# Altium schematic sheet ETH-PHY_SGMII_TI.SchDoc
size A4; CompanyName: Technische Hochschule Nürnberg Georg Simon Ohm; Organization: UltraZohm; Address1: Kesslerplatz 12; Address2: 90489 Nürnberg; Address3: GERMANY; Website: www.ultrazohm.com
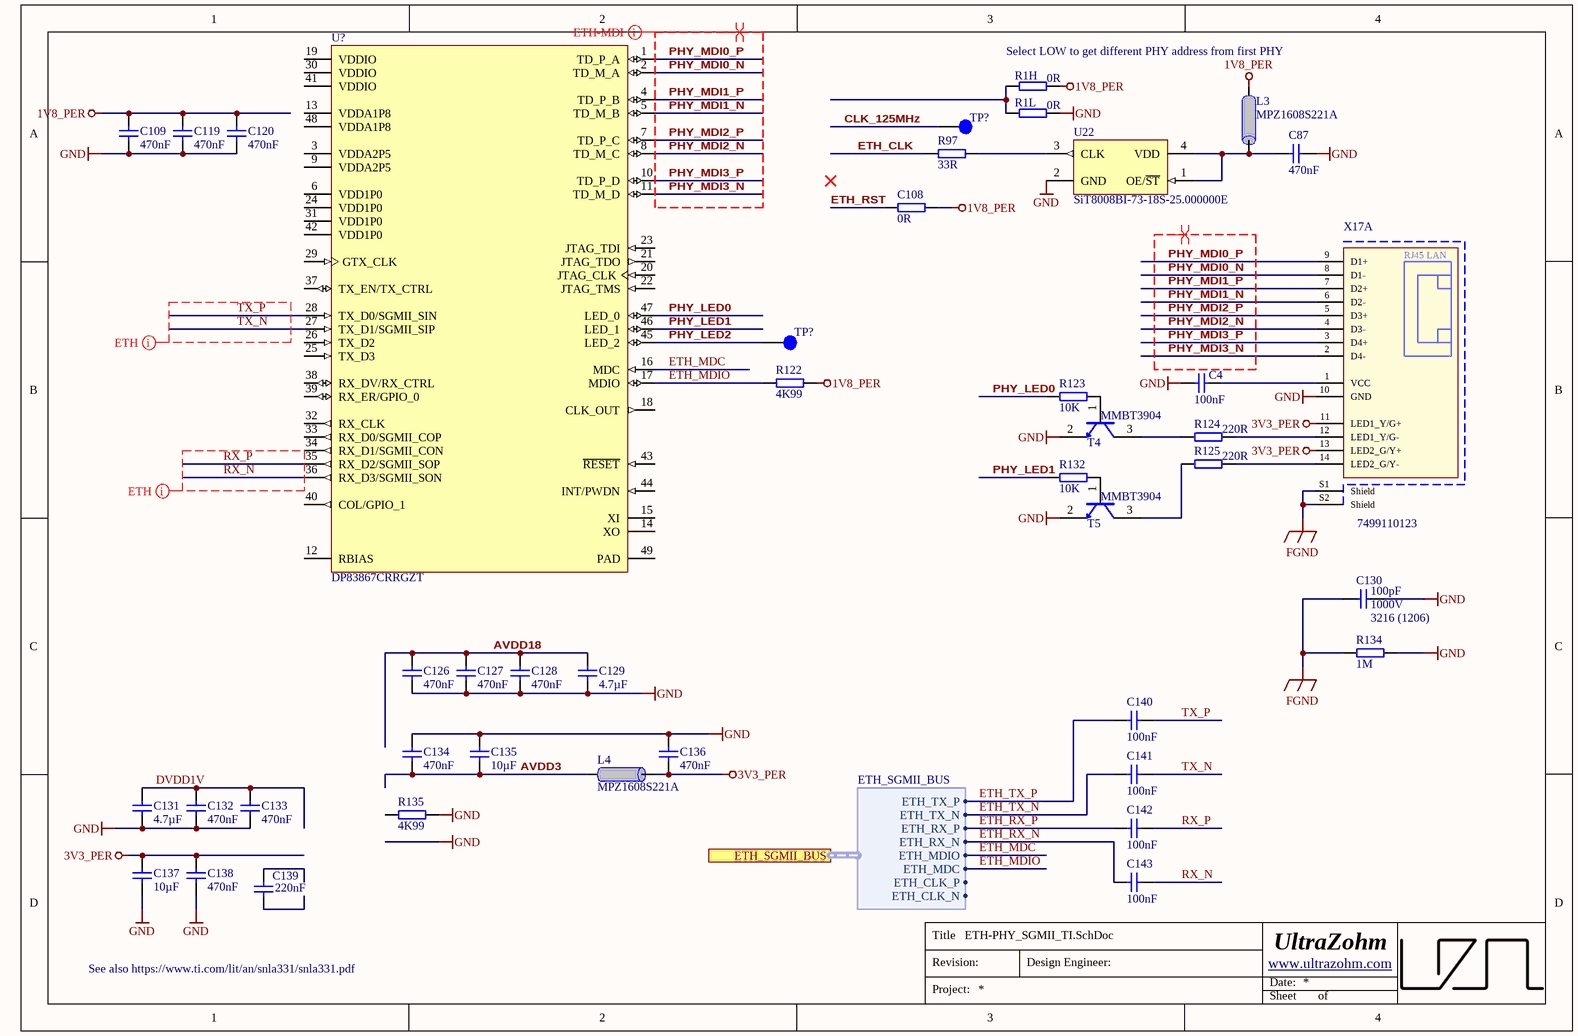
[diagram p0: ETH-PHY_SGMII_TI.SchDoc]

## Parts
(Parts that share a designator on the sheet are numbered #1, #2 ... from top to bottom, then left to right.)
C4  100nF  [CAPC1608X90N_V]
C87  470nF  [CAPC1608X90N_V]
C108  0R  [RESC1608X55N_V]
C109  470nF  [CAPC1608X90N_V]
C119  470nF  [CAPC1608X90N_V]
C120  470nF  [CAPC1608X90N_V]
C126  470nF  [CAPC1608X90N_V]
C127  470nF  [CAPC1608X90N_V]
C128  470nF  [CAPC1608X90N_V]
C129  4.7µF  [CAPC1608X90N_V]
C130  100pF  Voltage: 1000V  Case: 3216 (1206)  [CAPC3216X180N_V]
C131  4.7µF  [CAPC1608X90N_V]
C132  470nF  [CAPC1608X90N_V]
C133  470nF  [CAPC1608X90N_V]
C134  470nF  [CAPC1608X90N_V]
C135  10µF  [CAPC1608X90N_V]
C136  470nF  [CAPC1608X90N_V]
C137  10µF  [CAPC1608X90N_V]
C138  470nF  [CAPC1608X90N_V]
C139  220nF  [CAPC1608X90N_V]
C140  100nF  [CAPC1608X90N_V]
C141  100nF  [CAPC1608X90N_V]
C142  100nF  [CAPC1608X90N_V]
C143  100nF  [CAPC1608X90N_V]
L3  MPZ1608S221A  [INDC1608X95N_V]
L4  MPZ1608S221A  [INDC1608X95N_V]
R1H  0R  [RESC1608X55N_V]
R1L  0R  [RESC1608X55N_V]
R97  33R  [RESC1608X55N_V]
R122  4K99  [RESC1005X40N_V]
R123  10K  [RESC1608X55N_V]
R124  220R  [RESC1608X55N_V]
R125  220R  [RESC1608X55N_V]
R132  10K  [RESC1608X55N_V]
R134  1M  [RESC3216X65N_V]
R135  4K99  [RESC1005X40N_V]
T4  MMBT3904  [SOT95P280X145-3N]
T5  MMBT3904  [SOT95P280X145-3N]
TP?#1  Testpoint 1mm  [TP_1mm]  (value not drawn)
TP?#2  Testpoint 1mm  [TP_1mm]  (value not drawn)
U22  SiT8008BI-73-18S-25.000000E  [2016]
U?  DP83867CRRGZT  [QFN50P700X700X100T410X410N]
X17  7499110123  [7499110123]  (part A of 3)

## Ports
ETH_SGMII_BUS (harness ETH_SGMII_BUS)

## Harnesses
ETH_SGMII_BUS: ETH_CLK_N, ETH_CLK_P, ETH_MDC, ETH_MDIO, ETH_RX_N, ETH_RX_P, ETH_TX_N, ETH_TX_P

## Nets
1V8_PER: C108.2 C109.1 C119.1 C120.1 L3.1 R1H.2 R122.1
3V3_PER: C136.2 C137.1 C138.1 L4.2 X17.11(LED1_Y/G+) X17.13(LED2_G/Y+)
FGND: C130.1 R134.1 X17.S1(Shield) X17.S2(Shield)
GND: C4.2 C87.1 C109.2 C119.2 C120.2 C126.2 C127.2 C128.2 C129.2 C130.2 C131.2 C132.2 C133.2 C134.1 C135.1 C136.1 C137.2 C138.2 R1L.2 R134.2 R135.2 T4.2(EMITTER) T5.2(EMITTER) U22.2(GND) X17.10(GND)
AVDD3: C134.2 C135.2 L4.1
AVDD18: C126.1 C127.1 C128.1 C129.1
CLK_125MHz: TP?#1.1
DVDD1V: C131.1 C132.1 C133.1
ETH_CLK: R97.1
ETH_MDC: U?.16(MDC) ; port ETH_SGMII_BUS.ETH_MDIO
ETH_MDIO: R122.2 U?.17(MDIO) ; port ETH_SGMII_BUS.ETH_MDC
ETH_RST: C108.1
ETH_RX_N: C143.1 ; port ETH_SGMII_BUS.ETH_RX_N
ETH_RX_P: C142.1 ; port ETH_SGMII_BUS.ETH_RX_P
ETH_TX_N: C141.1 ; port ETH_SGMII_BUS.ETH_TX_N
ETH_TX_P: C140.1 ; port ETH_SGMII_BUS.ETH_TX_P
PHY_LED0: R123.1 U?.47(LED_0)
PHY_LED1: R132.1 U?.46(LED_1)
PHY_LED2: TP?#2.1 U?.45(LED_2)
PHY_MDI0_N: U?.2(TD_M_A) X17.8(D1-)
PHY_MDI0_P: U?.1(TD_P_A) X17.9(D1+)
PHY_MDI1_N: U?.5(TD_M_B) X17.6(D2-)
PHY_MDI1_P: U?.4(TD_P_B) X17.7(D2+)
PHY_MDI2_N: U?.8(TD_M_C) X17.4(D3-)
PHY_MDI2_P: U?.7(TD_P_C) X17.5(D3+)
PHY_MDI3_N: U?.11(TD_M_D) X17.2(D4-)
PHY_MDI3_P: U?.10(TD_P_D) X17.3(D4+)
RX_N: C143.2 U?.36(RX_D3/SGMII_SON)
RX_P: C142.2 U?.35(RX_D2/SGMII_SOP)
TX_N: C141.2 U?.27(TX_D1/SGMII_SIP)
TX_P: C140.2 U?.28(TX_D0/SGMII_SIN)
NetC4_1: C4.1 X17.1(VCC)
NetC87_2: C87.2 L3.2 U22.1(OE/~{ST}) U22.4(VDD)
NetR1H_1: R1H.1 R1L.1
NetR97_2: R97.2 U22.3(CLK)
NetR123_2: R123.2 T4.1(BASIS)
NetR124_1: R124.1 T4.3(COLLECTOR)
NetR124_2: R124.2 X17.12(LED1_Y/G-)
NetR125_1: R125.1 T5.3(COLLECTOR)
NetR125_2: R125.2 X17.14(LED2_G/Y-)
NetR132_2: R132.2 T5.1(BASIS)

Not connected (* = marked no-connect by the designer): C139 1 2; R135 1; U? 3(VDDA2P5) 6(VDD1P0) 9(VDDA2P5) 12(RBIAS) 13(VDDA1P8) 14(XO) 15(XI) 18(CLK_OUT) 19(VDDIO) 20(JTAG_CLK) 21(JTAG_TDO) 22(JTAG_TMS) 23(JTAG_TDI) 24(VDD1P0) 25(TX_D3) 26(TX_D2) 29(GTX_CLK) 30(VDDIO) 31(VDD1P0) 32(RX_CLK) 33(RX_D0/SGMII_COP) 34(RX_D1/SGMII_CON) 37(TX_EN/TX_CTRL) 38(RX_DV/RX_CTRL) 39(RX_ER/GPIO_0) 40(COL/GPIO_1) 41(VDDIO) 42(VDD1P0) 43(~{RESET}) 44(INT/PWDN) 48(VDDA1P8) 49(PAD)

## Layout directives
net class ETH: RX_N, RX_P, TX_N, TX_P
differential pair: PHY_MDI0_N, PHY_MDI0_P, PHY_MDI1_N, PHY_MDI1_P, PHY_MDI2_N, PHY_MDI2_P, PHY_MDI3_N, PHY_MDI3_P
net class ETH-MDI: PHY_MDI0_N, PHY_MDI0_P, PHY_MDI1_N, PHY_MDI1_P, PHY_MDI2_N, PHY_MDI2_P, PHY_MDI3_N, PHY_MDI3_P

## Notes on the sheet
- Select LOW to get different PHY address from first PHY
- See also https://www.ti.com/lit/an/snla331/snla331.pdf
- Title
- Revision:
- Design Engineer:
- Date:
- Project:
- Sheet
- of
- (in symbol 30726, part A) RJ45 LAN

## Library data of the parts
C4 = 21382: KON 100nF 50V X7R ±10% SMD BF 1608 (0603); Value: 100n; AN: 21382; Mixed: SMT; Preferred: Yes; Temperature-Range: -55/+125; Tolerance: ±10%; Voltage: 50V; Technology: X7R; Case: 1608 (0603)
C87 C109 C119 C120 C126-C128 C132-C134 C136 C138 = 25476: KON 470nF 50V X7R SMD  BF 1608 (0603); Value: 470n; AN: 25476; Mixed: SMT; Preferred: Yes; Temperature-Range: -55/+125; Voltage: 50V; Technology: X7R; Case: 1608 (0603)
C108 = 21491: WID SMD 0R 0,1W 1% TK100  BF 1608 (0603); Value: 0; AN: 21491; Mixed: SMT; Tolerance: 1%; Case: 1608 (0603); Technology: TK100
C129 C131 = 29699: KON 4.7µF 25V X5R 20%  SMD BF 1608 (0603); Value: 4.7u; AN: 29699; Mixed: SMT; Preferred: Yes; Temperature-Range: -55/+85; Tolerance: 20%; Voltage: 25V; Technology: X5R; Case: 1608 (0603)
C130 = 22679: KON 100pF 1000V X7R 10%  BF 3216 (1206); Value: 100p; AN: 22679; Mixed: SMT; Preferred: Yes; Temperature-Range: -55/+125; Tolerance: 10%; Technology: X7R
C135 C137 = 22918: KON 10µF 6,3V X5R SMD BF 1608 (0603); Value: 10u; Voltage: 6.3V; AN: 22918; Mixed: SMT; Temperature-Range: -55/+85; Technology: X5R; Case: 1608 (0603)
C139 = 29694: KON 220nF 50V X7R ±10% SMD BF 1608 (0603); Value: 220n; AN: 29694; Mixed: SMT; Temperature-Range: -55/+125; Tolerance: ±10%; Voltage: 50V; Technology: X7R; Case: 1608 (0603)
C140-C143 = 21382: KON 100nF 50V X7R ±10% SMD BF 1608 (0603); AN: 21382; Mixed: SMT; Value: 100n; Preferred: Yes; Temperature-Range: -55/+125; Voltage: 50V; Technology: X7R; Case: 1608 (0603); Tolerance: ±10%
L3 L4 = 22718: Ferritdurchführung MPZ1608S221A; Value: 220 OHm @ 100MHz; AN: 22718; Mixed: SMT; Trenz-Stock: Yes; Temperature-Range: -55/+125; Extra: 0,05 Ohm DC, 220 Ohm bei 100MHz. 2A; Case: 1608 (0603); HelpURL: B:\AD\adlib\datasheet\MPZ1608; Preferred: Yes; H-ART: MPZ1608S221A; Storage-Temperature: -55/+125
R1H R1L = 21491: WID SMD 0R 0,1W 1% TK100  BF 1608 (0603); AN: 21491; Mixed: SMT; Value: 0; Tolerance: 1%; Case: 1608 (0603); Technology: TK100
R97 = 22430: WID SMD 33R 1% 0,1W; Value: 33; AN: 22430; Mixed: SMT; Extra: BF 1608 (0603); Tolerance: 1%; Case: 1608 (0603); Technology: TK100
R122 R135 = 22754: WID SMD 4K99 1% 0,063W BF 1005 (0402); AN: 22754; Mixed: SMT; Value: 4.99K; Preferred: Yes; H-ART: RC0402FR-074K99L; Tolerance: 1%; Case: 1005 (0402); Technology: TK100
R123 R132 = 21492: WID SMD 10K 1% 0,1W  BF 1608 (0603); AN: 21492; Mixed: SMT; Preferred: Yes; Value: 10K; Tolerance: 1%; Case: 1608 (0603); Technology: TK100
R124 R125 = 22324: WID SMD 220R 1% 0,1W; Value: 220; AN: 22324; Mixed: SMT; Extra: BF 1608 (0603); Tolerance: 1%; Case: 1608 (0603); Technology: TK100
R134 = 22757: WID SMD 1M 5% 0,25W  BF 3216 (1206); AN: 22757; Mixed: SMT; Preferred: Yes; Value: 1M; Tolerance: 5%; Case: 3216 (1206); Technology: TK100
T4 T5 = 23806: AN: 23806; Mixed: SMT; Trenz-Stock: Yes; Extra: NPN General Purpose Amplifier; Case: SOT23-3; HelpURL: B:\AD\adlib\datasheet\MMBT3904; Preferred: Yes; H-ART: MMBT3904
TP?#1 TP?#2 = 25063: AN: 25063; Mixed: SMT
U22 = 27228: SiT8008BI-73-18S-25.000000E MEMS Oszillator 25.000000MHz; Value: 25M; Voltage: 1.8V; AN: 27228; Mixed: SMT; Preferred: Yes; Temperature-Range: -40/+85; Extra: 1.8V , -40° C - 85° C , ±50 ppm , 2x1,6 mm; HelpURL: B:\AD\adlib\datasheet\SiT8008; Case: 2.0  x 1.6mm; H-ART: SIT8008BI-73-18S-25.000000E; Storage-Temperature: -65/+150 (Abs)
U? = 27942: AN: 27942; Mixed: SMT; Extra: Robust, High Immunity 10/100/1000 Ethernet PHY; Case: QFN48; HelpURL: b:\AD\adlib\datasheet\TI_DP83867\; H-ART: DP83867CRRGZT
X17 = 30726: LAN-Transformer 10/100/1000 BaseT; AN: 30726; Mixed: THT; Trenz-Stock: Yes; Temperature-Range: -40/+85; Extra: 7499110123, -40 to +85 °C, 0°; HelpURL: b:\AD\adlib\datasheet\Wuerth\WE-RJ45\7499110123\; H-ART: 7499110123